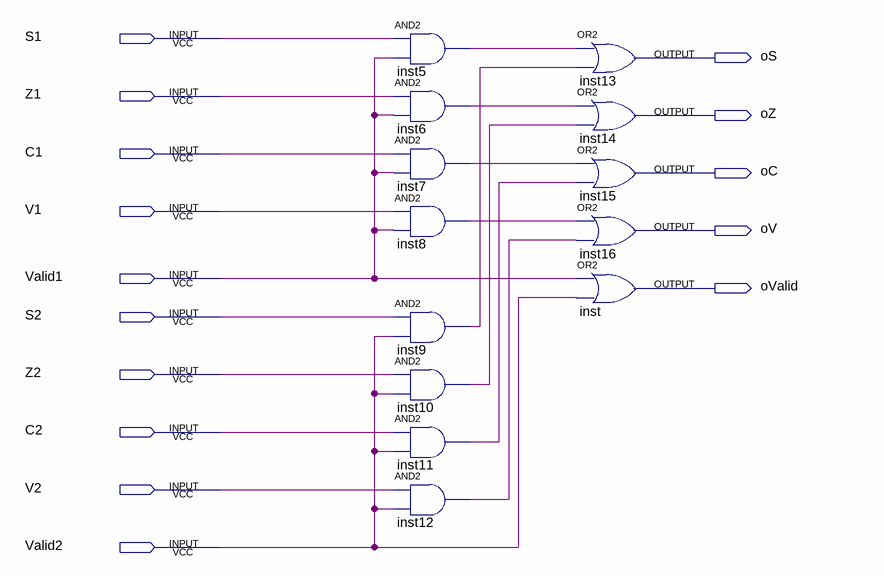
[diagram p0: schematic sheet]
// Quartus schematic mergeSZCV.bdf as structural Verilog: 13 symbols, 15 pins
module mergeSZCV (
  input  S1,
  input  Z1,
  input  C1,
  input  V1,
  input  Valid1,
  input  S2,
  input  Z2,
  input  C2,
  input  V2,
  input  Valid2,
  output oS,
  output oZ,
  output oC,
  output oV,
  output oValid
);

  wire inst5_out, inst6_out, inst7_out, inst8_out, inst9_out, inst10_out, inst11_out, inst12_out;

  and inst5 (inst5_out, S1, Valid1);
  and inst6 (inst6_out, Z1, Valid1);
  and inst7 (inst7_out, C1, Valid1);
  and inst8 (inst8_out, V1, Valid1);
  and inst9 (inst9_out, S2, Valid2);
  and inst10 (inst10_out, Z2, Valid2);
  and inst11 (inst11_out, C2, Valid2);
  and inst12 (inst12_out, V2, Valid2);
  or inst13 (oS, inst5_out, inst9_out);
  or inst14 (oZ, inst6_out, inst10_out);
  or inst15 (oC, inst7_out, inst11_out);
  or inst16 (oV, inst8_out, inst12_out);
  or inst (oValid, Valid1, Valid2);
endmodule
